# EAGLE schematic rgb-board (EAGLE 7.7.0)
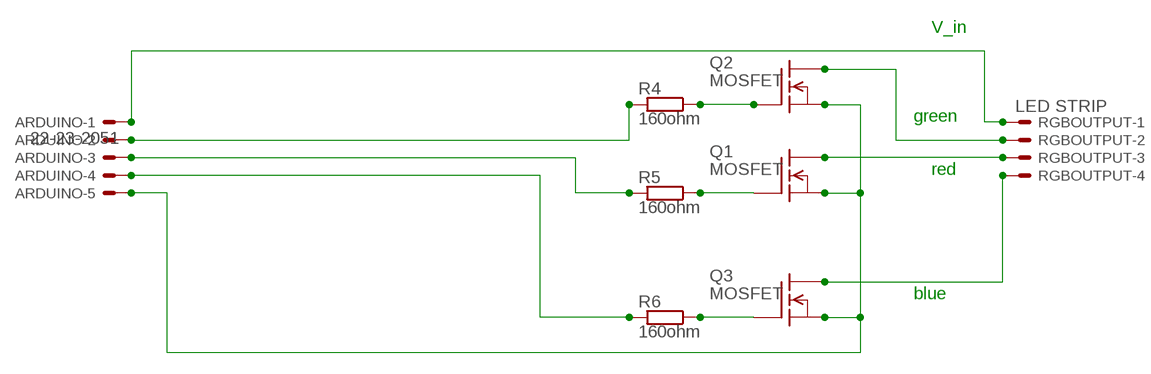
[diagram p0: schematic, sheet 1]

## Parts
ARDUINO  22-23-2051  [22-23-2051]
Q1  MOSFET  BUZ71  [TO220]
Q2  MOSFET  BUZ71  [TO220]
Q3  MOSFET  BUZ71  [TO220]
R4  160ohm  SMR-WAV  [SMS-WAV]
R5  160ohm  SMR-WAV  [SMS-WAV]
R6  160ohm  SMR-WAV  [SMS-WAV]
RGBOUTPUT  LED STRIP  22-23-2041  [22-23-2041]

## Nets
BLUE: Q3.2(D) RGBOUTPUT.4
BLUE2: ARDUINO.4 R6.2
GND: ARDUINO.5 Q1.3(S) Q2.3(S) Q3.3(S)
GREEN: Q2.2(D) RGBOUTPUT.2
GREEN2: ARDUINO.2 R4.2
N$5: Q2.1(G) R4.1
N$6: Q1.1(G) R5.1
N$7: Q3.1(G) R6.1
RED: Q1.2(D) RGBOUTPUT.3
RED2: ARDUINO.3 R5.2
VIN: ARDUINO.1 RGBOUTPUT.1

## Notes on the sheet
- V_in
- green
- red
- blue

## Library data of the parts
ARDUINO = con-molex:22-23-2051: .100" (2.54mm) Center Header - 5 Pin; MF: MOLEX; MPN: 22-23-2051; OC_FARNELL: 1462952; OC_NEWARK: 38C9178
Q1-Q3 = transistor-fet:BUZ71: N-Channel Enhancement MOSFET 50V; 14A; 0,1Ohm
R4-R6 = resistor-shunt:SMR-WAV: SMD SHUNT RESISTOR; OC_FARNELL: unknown; OC_NEWARK: unknown
RGBOUTPUT = con-molex:22-23-2041: .100" (2.54mm) Center Header - 4 Pin; MF: MOLEX; MPN: 22-23-2041; OC_FARNELL: 1462920; OC_NEWARK: 38C0355